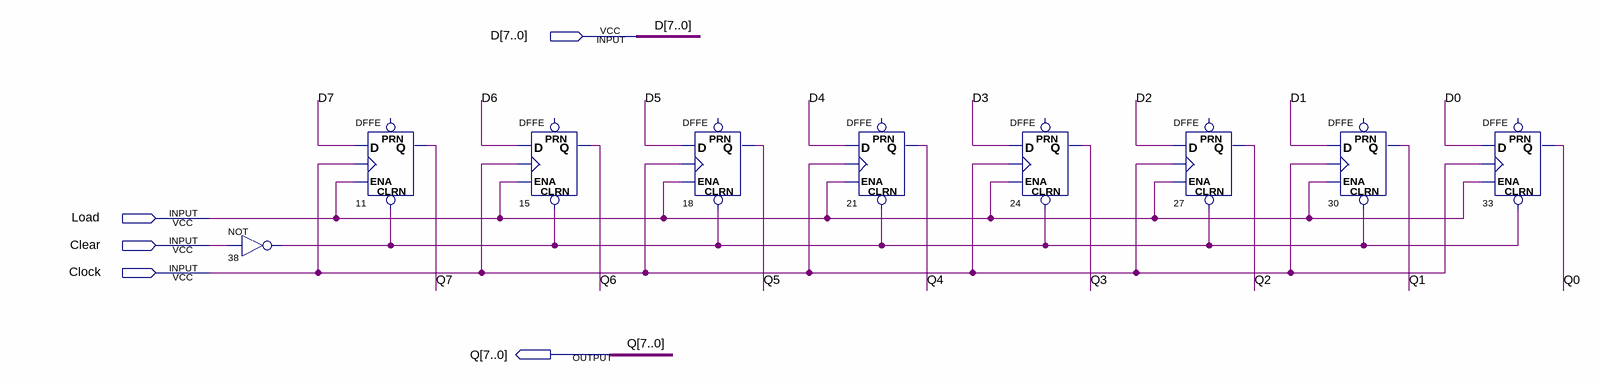
[diagram p0: schematic sheet]
// Quartus schematic reg8.bdf as structural Verilog: 9 symbols, 5 pins
module reg8 (
  input  [7:0] D,
  input  Load,
  input  Clear,
  input  Clock,
  output [7:0] Q
);

  wire n38_out;

  not u_38 (n38_out, Clear);
  DFFE u_11 (.CLRN(n38_out), .D(D[7]), .CLK(Clock), .ENA(Load), .Q(Q[7]));  // open: PRN
  DFFE u_15 (.CLRN(n38_out), .D(D[6]), .CLK(Clock), .ENA(Load), .Q(Q[6]));  // open: PRN
  DFFE u_18 (.CLRN(n38_out), .D(D[5]), .CLK(Clock), .ENA(Load), .Q(Q[5]));  // open: PRN
  DFFE u_21 (.CLRN(n38_out), .D(D[4]), .CLK(Clock), .ENA(Load), .Q(Q[4]));  // open: PRN
  DFFE u_24 (.CLRN(n38_out), .D(D[3]), .CLK(Clock), .ENA(Load), .Q(Q[3]));  // open: PRN
  DFFE u_27 (.CLRN(n38_out), .D(D[2]), .CLK(Clock), .ENA(Load), .Q(Q[2]));  // open: PRN
  DFFE u_30 (.CLRN(n38_out), .D(D[1]), .CLK(Clock), .ENA(Load), .Q(Q[1]));  // open: PRN
  DFFE u_33 (.CLRN(n38_out), .D(D[0]), .CLK(Clock), .ENA(Load), .Q(Q[0]));  // open: PRN
endmodule
